# EAGLE schematic esp7segcounter-v1 (EAGLE 6.6.0)
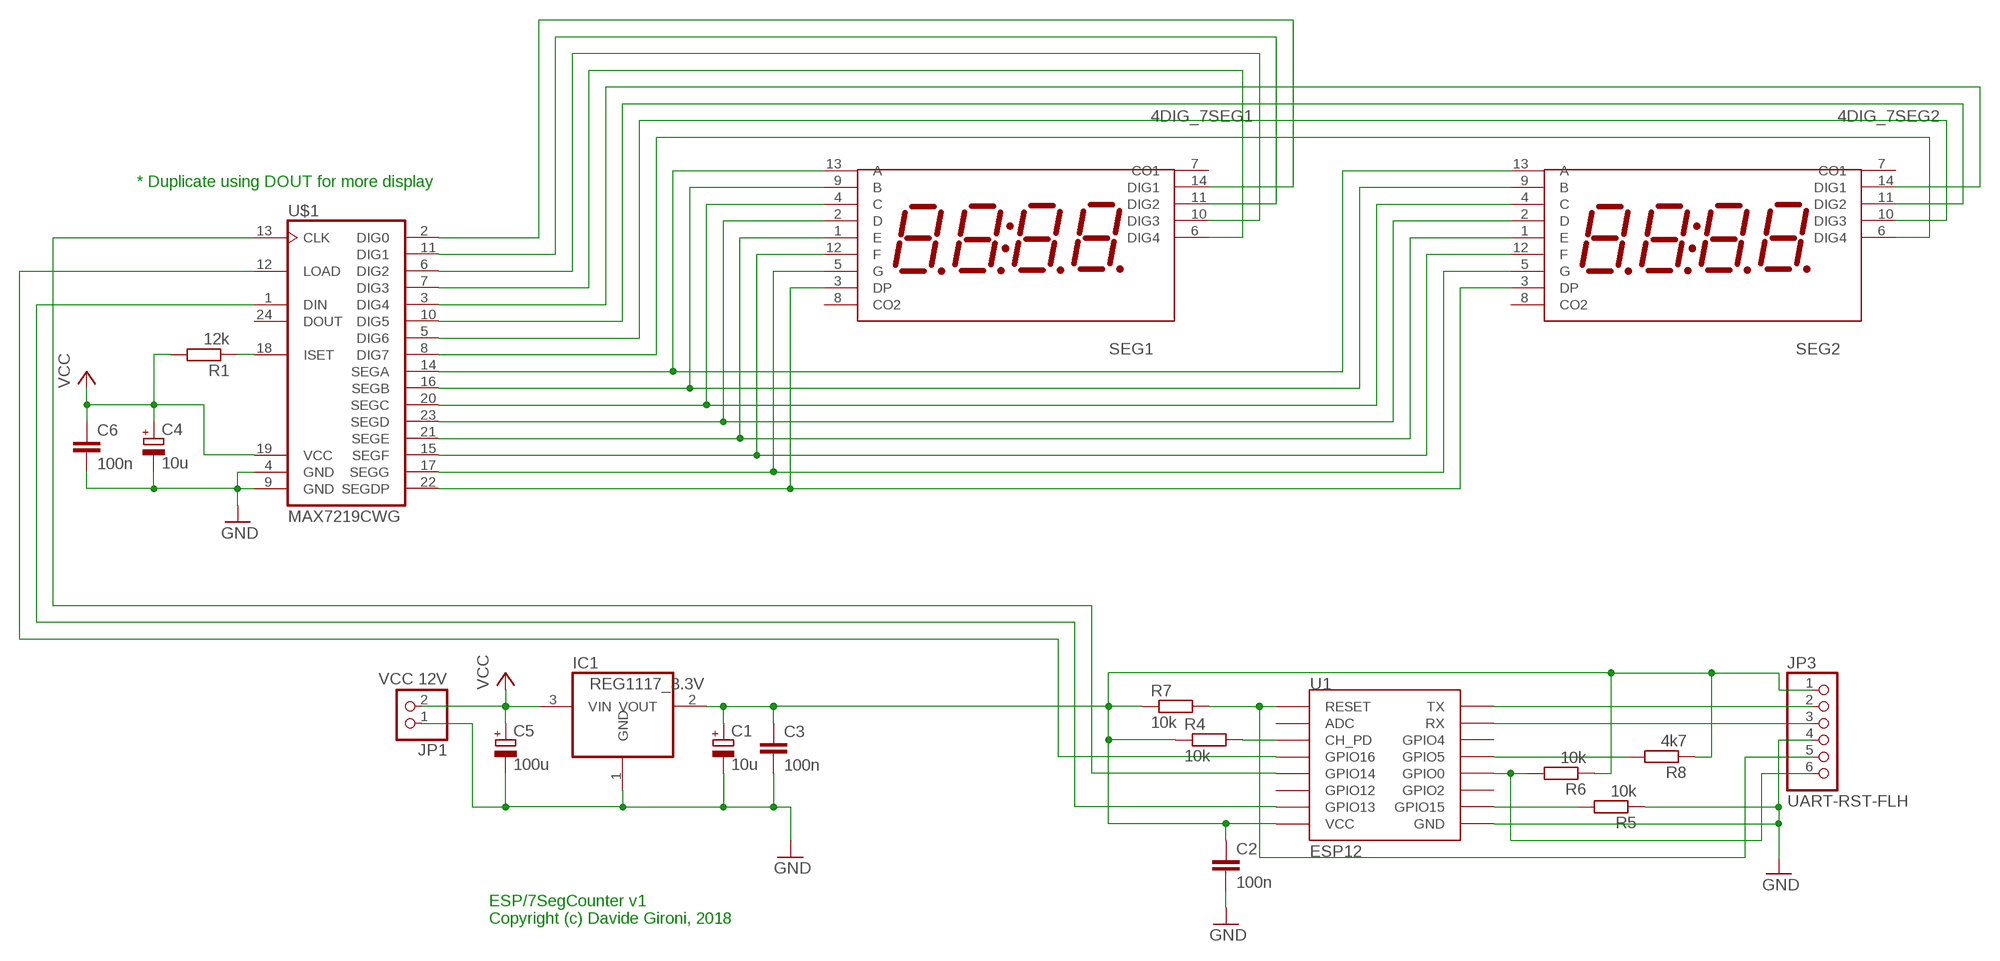
[diagram p0: schematic, sheet 1]

## Parts
4DIG_7SEG1  SEG1  4DIG_7SEG  [4DIG_7SEG]
4DIG_7SEG2  SEG2  4DIG_7SEG  [4DIG_7SEG]
C1  10u  CPOL-EUB/3528-21R  [B/3528-21R]
C2  100n  C-EUC0603  [C0603]
C3  100n  C-EUC0603  [C0603]
C4  10u  CPOL-EUB/3528-21R  [B/3528-21R]
C5  100u  CPOL-EUE3.5-8  [E3,5-8]
C6  100n  C-EUC0603  [C0603]
IC1  REG1117_3.3V  REG1117  [SOT223]
JP1  VCC 12V  PINHD-1X2  [1X02]
JP3  UART-RST-FLH  PINHD-1X6  [1X06]
R1  12k  R-EU_R0603  [R0603]
R4  10k  R-EU_R0603  [R0603]
R5  10k  R-EU_R0603  [R0603]
R6  10k  R-EU_R0603  [R0603]
R7  10k  R-EU_R0603  [R0603]
R8  4k7  R-EU_R0603  [R0603]
U1  ESP12  ESP12SMD  [ESP12-SMD]
U$1  MAX7219CWG  [SO24L]

## Nets
GND: C1.- C2.2 C3.2 C4.- C5.- C6.2 IC1.1(GND) JP1.1 JP3.4 R5.1 U1.GND U$1.4(GND) U$1.9(GND)
N$1: R4.2 U1.CH_PD
N$2: R8.2 U1.GPIO5
N$3: C1.+ C2.1 C3.1 IC1.2(VOUT) JP3.1 R4.1 R6.1 R7.1 R8.1 U1.VCC
N$4: JP3.2 U1.TXD0(TX)
N$5: JP3.3 U1.RXD0(RX)
N$6: 4DIG_7SEG1.3(DP) 4DIG_7SEG2.3(DP) U$1.22(SEGDP)
N$7: 4DIG_7SEG1.5(G) 4DIG_7SEG2.5(G) U$1.17(SEGG)
N$8: R5.2 U1.GPIO15
N$9: JP3.6 R6.2 U1.GPIO0
N$10: 4DIG_7SEG1.12(F) 4DIG_7SEG2.12(F) U$1.15(SEGF)
N$11: JP3.5 R7.2 U1.RESET
N$12: 4DIG_7SEG1.1(E) 4DIG_7SEG2.1(E) U$1.21(SEGE)
N$13: 4DIG_7SEG1.2(D) 4DIG_7SEG2.2(D) U$1.23(SEGD)
N$14: 4DIG_7SEG1.4(C) 4DIG_7SEG2.4(C) U$1.20(SEGC)
N$15: 4DIG_7SEG1.9(B) 4DIG_7SEG2.9(B) U$1.16(SEGB)
N$16: 4DIG_7SEG1.13(A) 4DIG_7SEG2.13(A) U$1.14(SEGA)
N$17: R1.1 U$1.18(ISET)
N$18: 4DIG_7SEG2.6(DIG4) U$1.8(DIG7)
N$19: 4DIG_7SEG2.11(DIG2) U$1.10(DIG5)
N$20: U1.GPIO14 U$1.13(CLK)
N$21: 4DIG_7SEG2.14(DIG1) U$1.3(DIG4)
N$22: 4DIG_7SEG1.6(DIG4) U$1.7(DIG3)
N$23: 4DIG_7SEG1.10(DIG3) U$1.6(DIG2)
N$24: 4DIG_7SEG1.11(DIG2) U$1.11(DIG1)
N$25: 4DIG_7SEG1.14(DIG1) U$1.2(DIG0)
N$26: U1.GPIO13 U$1.1(DIN)
N$27: U1.GPIO16 U$1.12(LOAD)
N$28: 4DIG_7SEG2.10(DIG3) U$1.5(DIG6)
VCC: C4.+ C5.+ C6.1 IC1.3(VIN) JP1.2 R1.2 U$1.19(VCC)
Unconnected: 4DIG_7SEG1.7(CO1) 4DIG_7SEG1.8(CO2) 4DIG_7SEG2.7(CO1) 4DIG_7SEG2.8(CO2) U1.ADC U1.GPIO2 U1.GPIO4 U1.GPIO12 U$1.24(DOUT)

## Notes on the sheet
- * Duplicate using DOUT for more display
- ESP/7SegCounter v1
  Copyright (c) Davide Gironi, 2018

## Library data of the parts
4DIG_7SEG1 4DIG_7SEG2 = 7-seg-disp:4DIG_7SEG: This library is modified to the Adafruit 4dig7seg display, part# KW4-56NCBA-P. It doesn't have the up decimal, and the pins are reassigned. This is common cathode. This library was based on BL-Q39A42 respectively BL-Q39B42 display but support many others displays where PAD/PIN assign is same.Display may be common cathode or common anode because PAD/PIN assign is still the same. PIN DESCRIPTION: DIG1-DIG4 : common cathode or common anode of digit CO1-CO2: cathode or anode of colon (Depends on the display), DIG1-DIG4: common cathodes or anodes of digits, A - G+ DP: cathodes or anodes of segments A to F with dot point . Made by: www.developrog.com, modified by Kiki Jewell 2016
C1 C4 C5 = rcl:CPOL-EU: POLARIZED CAPACITOR, European symbol
C2 C3 C6 = rcl:C-EU: CAPACITOR, European symbol
IC1 = burr-brown:REG1117: 800mA and 1A Low Dropout (LDO) Positive Regulator 1.8V, 2.5V, 2.85V, 3.3V, 5V, and Adj; MPN: REG1117; OC_FARNELL: 1097566; OC_NEWARK: 14P6981
JP1 = pinhead:PINHD-1X2: PIN HEADER
JP3 = pinhead:PINHD-1X6: PIN HEADER
R1 R4-R8 = rcl:R-EU_: RESISTOR, European symbol
U1 = esp8266modules:ESP12: ESP8266 Wifi module 12
U$1 = max7219:MAX7219CWG